# EAGLE design MaTouch DevKit_1.28“ Controller V1.1 (EAGLE 6.1)
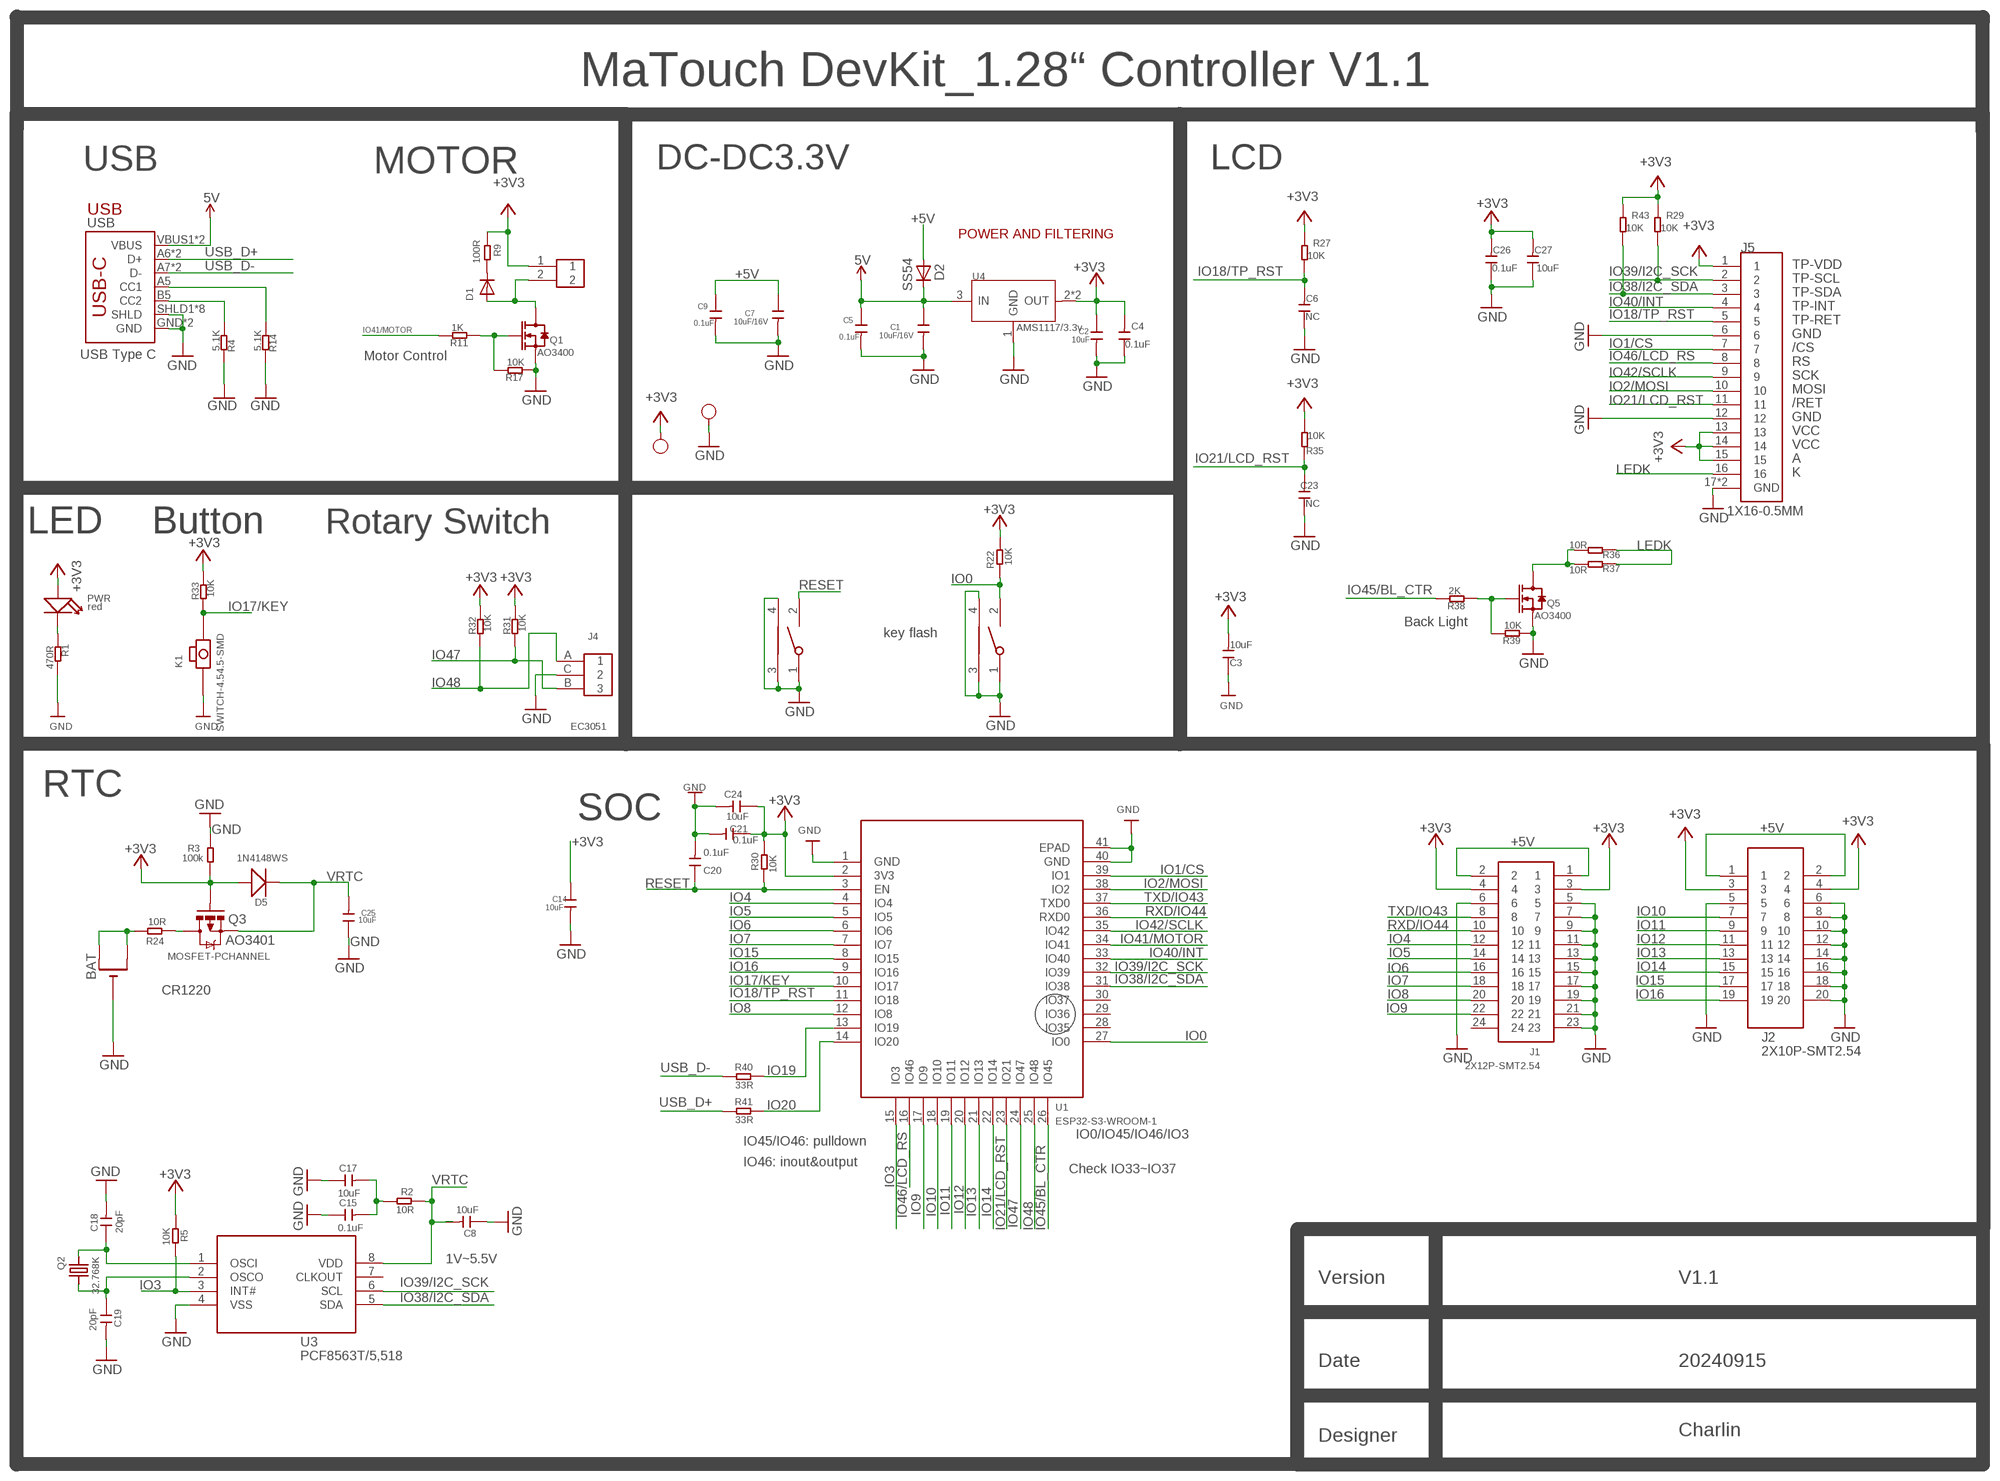
[diagram p0: schematic, sheet 1]

## Parts
3V3  TEST-POINT'4545'  [TP-D45MIL]
BAT  CR1220SMT  [CR1220-SMD]
BOOT  TS24CA  [2*4*3.5MM]
C1  10uF/16V  C-0603  [0603]
C2  10uF  C-0603  [0603]
C3  10uF  DISCRETE_C-0603  [DISCRETE_C0603]
C4  0.1uF  DISCRETE_C-0402  [DISCRETE_C0402]
C5  0.1uF  C-0603  [0603]
C6  NC  DISCRETE_C-0402  [DISCRETE_C0402]
C7  10uF/16V  C-0603  [0603]
C8  10uF  DISCRETE_C-0603  [DISCRETE_C0603]
C9  0.1uF  C-0603  [0603]
C14  10uF  C-0603  [0603]
C15  0.1uF  DISCRETE_C-0603  [DISCRETE_C0603]
C17  10uF  DISCRETE_C-0603  [DISCRETE_C0603]
C18  20pF  DISCRETE_C-0603  [DISCRETE_C0603]
C19  20pF  DISCRETE_C-0603  [DISCRETE_C0603]
C20  0.1uF  DISCRETE_C-0603  [DISCRETE_C0603]
C21  0.1uF  DISCRETE_C-0603  [DISCRETE_C0603]
C23  NC  DISCRETE_C-0402  [DISCRETE_C0402]
C24  10uF  DISCRETE_C-0603  [DISCRETE_C0603]
C25  10uF  C-0603  [0603]
C26  0.1uF  DISCRETE_C-0402  [DISCRETE_C0402]
C27  10uF  DISCRETE_C-0402  [DISCRETE_C0402]
D1  DIODESOD-323F  [SOD-323F]
D2  SS54  DIODE-DO-214AC  [DO-214AC]
D5  1N4148WS  D'0805'  [SOD323]
GND  TEST-POINT'4545'  [TP-D45MIL]
J1  2X12P-SMT2.54  [2X12P-SMT2.54]
J2  2X10P-SMT2.54  [2X10P-SMT2.54]
J4  EC3051  [MAKERFABS_EC3051]
J5  1X16-0.5MM  [1X16-0.5MM]
K1  SWITCH-4.54.5-SMD  [SWITCH-4.5*4.5-SMD]
MOTOR  CN-1.02P  [SH1.0-2P-SMD]
PWR  red  DISCRETE_LED0603  [DISCRETE_LED-0603]
Q1  AO3400  MOSFET-N'SOT23'  [SOT23@1]
Q2  32.768K  CRYSTAL_3215  [XTAL3215]
Q3  MOSFET-PCHANNEL  [SOT23-3]
Q5  AO3400  MOSFET-N'SOT23'  [SOT23@1]
R1  470R  DISCRETE_R-0402  [DISCRETE_R0402]
R2  10R  R-0603  [R0603]
R3  100k  R-0603  [R0603]
R4  5.1K  DISCRETE_R-0402  [DISCRETE_R0402]
R5  10K  R-0603  [R0603]
R9  100R  DISCRETE_R-0402  [DISCRETE_R0402]
R11  1K  DISCRETE_R-0402  [DISCRETE_R0402]
R14  5.1K  DISCRETE_R-0402  [DISCRETE_R0402]
R17  10K  DISCRETE_R-0402  [DISCRETE_R0402]
R22  10K  R-0603  [R0603]
R24  10R  R-0603  [R0603]
R27  10K  DISCRETE_R-0402  [DISCRETE_R0402]
R29  10K  DISCRETE_R-0402  [DISCRETE_R0402]
R30  10K  R-0603  [R0603]
R31  10K  DISCRETE_R-0402  [DISCRETE_R0402]
R32  10K  DISCRETE_R-0402  [DISCRETE_R0402]
R33  10K  DISCRETE_R-0402  [DISCRETE_R0402]
R35  10K  DISCRETE_R-0402  [DISCRETE_R0402]
R36  10R  DISCRETE_R-0402  [DISCRETE_R0402]
R37  10R  DISCRETE_R-0402  [DISCRETE_R0402]
R38  2K  DISCRETE_R-0402  [DISCRETE_R0402]
R39  10K  DISCRETE_R-0402  [DISCRETE_R0402]
R40  33R  R-0603  [R0603]
R41  33R  R-0603  [R0603]
R43  10K  DISCRETE_R-0402  [DISCRETE_R0402]
RST  TS24CA  [2*4*3.5MM]
U1  ESP32-S3-WROOM-1  [ESP32-S3-WROOM-1]
U3  PCF8563T/5,518  [SOP8]
U4  AMS1117/3.3v  LD1117'SOT89'  [SOT89]
USB  USB_C5  [USB-C-16P-5]

## Nets
5V: C1.1 C5.1 D2.C U4.3(IN) USB.VBUS1(VBUS) USB.VBUS2(VBUS)
+3V3: 3V3.T C2.1 C3.2 C4.2 C14.1 C21.1 C24.1 C26.2 C27.2 D5.+ J1.3 J1.4 J2.3 J2.4 J5.1 J5.13 J5.14 J5.15 MOTOR.1 PWR.+ Q3.1(G) R3.1 R5.1 R9.1 R22.2 R27.2 R29.2 R30.2 R31.1 R32.1 R33.1 R35.2 R43.2 U1.2(3V3) U4.2(OUT) U4.4(OUT)
+5V: C7.1 C9.1 D2.A J1.1 J1.2 J2.1 J2.2
GND: BAT.- BOOT.1 BOOT.3 BOOT.4 C1.2 C2.2 C3.1 C4.1 C5.2 C6.1 C7.2 C8.1 C9.2 C14.2 C15.1 C17.1 C18.2 C19.2 C20.2 C21.2 C23.1 C24.2 C25.1 C26.1 C27.1 GND.T J1.5 J1.6 J1.7 J1.9 J1.11 J1.13 J1.15 J1.17 J1.19 J1.21 J1.23 J2.5 J2.6 J2.8 J2.10 J2.12 J2.14 J2.16 J2.18 J2.20 J4.C J5.6 J5.12 J5.17(GND) J5.18(GND) K1.1 K1.4 Q1.2(S) Q5.2(S) R1.1 R3.2 R4.2 R14.2 R17.1 R39.1 RST.1 RST.3 RST.4 U1.1(GND) U1.40(GND) U1.41(EPAD) U3.4(VSS) U4.1(GND) USB.GND USB.GND2(GND) USB.SHLD1(SHLD) USB.SHLD2(SHLD) USB.SHLD3(SHLD) USB.SHLD4(SHLD) USB.SHLD5(SHLD) USB.SHLD6(SHLD) USB.SHLD7(SHLD) USB.SHLD8(SHLD)
IO0: BOOT.2 R22.1 U1.27(IO0)
IO1/CS: J5.7 U1.39(IO1)
IO2/MOSI: J5.10 U1.38(IO2)
IO3: R5.2 U1.15(IO3) U3.3(INT#)
IO4: J1.12 U1.4(IO4)
IO5: J1.14 U1.5(IO5)
IO6: J1.16 U1.6(IO6)
IO7: J1.18 U1.7(IO7)
IO8: J1.20 U1.12(IO8)
IO9: J1.22 U1.17(IO9)
IO10: J2.7 U1.18(IO10)
IO11: J2.9 U1.19(IO11)
IO12: J2.11 U1.20(IO12)
IO13: J2.13 U1.21(IO13)
IO14: J2.15 U1.22(IO14)
IO15: J2.17 U1.8(IO15)
IO16: J2.19 U1.9(IO16)
IO17/KEY: K1.2 K1.3 R33.2 U1.10(IO17)
IO18/TP_RST: C6.2 J5.5 R27.1 U1.11(IO18)
IO19: R40.2 U1.13(IO19)
IO20: R41.2 U1.14(IO20)
IO21/LCD_RST: C23.2 J5.11 R35.1 U1.23(IO21)
IO38/I2C_SDA: J5.3 R43.1 U1.31(IO38) U3.5(SDA)
IO39/I2C_SCK: J5.2 R29.1 U1.32(IO39) U3.6(SCL)
IO40/INT: J5.4 U1.33(IO40)
IO41/MOTOR: R11.2 U1.34(IO41)
IO42/SCLK: J5.9 U1.35(IO42)
IO45/BL_CTR: R38.2 U1.26(IO45)
IO46/LCD_RS: J5.8 U1.16(IO46)
IO47: J4.B R31.2 U1.24(IO47)
IO48: J4.A R32.2 U1.25(IO48)
LEDK: J5.16 R36.1 R37.1
M-: D1.A MOTOR.2 Q1.3(D)
N$1: Q1.1(G) R11.1 R17.2
N$2: C15.2 C17.2 R2.1
N$3: BAT.+$1(+) BAT.+$2(+1) R24.2
N$4: C18.1 Q2.P$1 U3.1(OSCI)
N$6: R14.1 USB.A5(CC1)
N$7: PWR.- R1.2
N$8: D1.C R9.2
N$13: C19.1 Q2.P$2 U3.2(OSCO)
N$14: R4.1 USB.B5(CC2)
N$15: Q3.3(D) R24.1
N$20: Q5.1(G) R38.1 R39.2
N$22: Q5.3(D) R36.2 R37.2
RESET: C20.1 R30.1 RST.2 U1.3(EN)
RXD/IO44: J1.10 U1.36(RXD0)
TXD/IO43: J1.8 U1.37(TXD0)
USB_D+: R41.1 USB.A6(D+) USB.B6(D+)
USB_D-: R40.1 USB.A7(D-) USB.B7(D-)
VRTC: C8.2 C25.2 D5.- Q3.2(S) R2.2 U3.8(VDD)
Unconnected: J1.24 U1.28(IO35) U1.29(IO36) U1.30(IO37) U3.7(CLKOUT)

## Notes on the sheet
- MaTouch DevKit_1.28“ Controller V1.1
- USB | MOTOR | DC-DC3.3V | LCD
- USB
- POWER AND FILTERING
- TP-VDD
- TP-SCL
- TP-SDA
- TP-INT
- TP-RET
- GND
- /CS
- USB Type C | Motor Control
- RS
- SCK
- MOSI
- /RET
- GND
- VCC
- VCC
- A
- K
- LED | Button | Rotary Switch
- Back Light
- key flash
- RTC
- SOC
- AO3401
- CR1220
- IO0/IO45/IO46/IO3
- IO45/IO46: pulldown
- IO46: inout&output
- Check IO33~IO37
- 1V~5.5V
- Version | V1.1
- Date | 20240915
- Charlin
- Designer

## Library data of the parts
3V3 GND = Discrete-new:TEST-POINT; PARTNO: DNP
BAT = adafruit:CR1220: CR1216/CR1220/CR1225 12mm 3V lithium coin cell Great for battery packup. Both SMT and THM holders. Note the THM package has the ground pads on both sides of the PCB so that the masks are the same - this reduces the cost
BOOT RST = sale:TS24CA
C1 C2 C5 C7 C9 C14 C25 = Discrete:C*: Ceramic Capacitors
C3 C4 C6 C8 C15 C17-C21 C23 C24 C26 C27 = A9G:DISCRETE_C*: Ceramic Capacitors
D1 = adafruit2:DIODE: Diode SMADIODE - SMA Surface Mount Package 20V 1A Schottky Diode Digikey: 641-1014-6-ND DO-1N4148 - Through Hole Small Current Diode SOD-123 20V 1 A (.5mV Vf) Schottky Diode - Digikey: MBRX120TPMSCT-ND SOD-323 10V 570mA (.38mV Vf, 3ns) Schottky Diode - Digikey: ZLLS410CT-ND SOD-523 30V 30mA Schottky Diode (RB751S-40TE61) - Digikey: RB751S-40TE61CT-ND SOT23-R/W - SOT23 Package (R = Solder Paste/Reflow Ovens, W = Hand-Soldering) BAT54Film 40V 300mA - Digikey: 497-7162-1-ND
D2 = diode:DIODE-: DIODE
D5 = Discrete:D*
J1 = sale:2X12P-SMT2.54
J2 = sale:2X10P-SMT2.54
J4 = Makerfabs-Peter:EC3051
J5 = Makerfabs:1X16-0.5MM
K1 = Makerfabs:SWITCH-4.5*4.5-SMD
MOTOR = Makerfabs-Peter:CN-1.0*2P
PWR = A9G:DISCRETE_LED*
Q1 Q5 = Discrete:MOSFET-N: IRLL014: http://www.vishay.com/docs/91319/sihll014.pdf
Q2 = microbuilder:CRYSTAL: Crystals HC49UP - Surface Mount Crystal 4.0MHz 18pF +/-30ppm Surface Mount Crystal [Digikey: 535-9857-1-ND] 12.0 MHz Surface Mount Crystal [Digikey: 535-9869-6-ND] 25.0 MHz Surface Mount Crystal [Digikey: 535-9078-1-ND] 2.5 x 2.0mm - MEMs SMT Crystal 16.0 MHz 10pF 20ppm 2.5 x 2.0mm Crystal [Digikey -40-85°C: 535-10923-1-ND] 3.2 x 2.5mm - MEMs SMT Crystal 12.0 MHz 8pF 15ppm 3.2 x 2.5mm Crystal [Digikey: -10-70°C: 644-1047-1-ND -40-125°C: 644-1128-1-ND] 40~85°C cheaper: 644-1173-6-ND 16.0 MHz 8pF 15ppm 3.2 x 2.5mm Crystal [Digikey: -10-70°C: 644-1049-1-ND -40-125°C: 644-1129-2-ND]-40~85°C cheaper: 644-1175-6-ND 16.0 MHz 10pF 10ppm 3.2 x 2.5mm Crystal [Digikey: 644-1100-1-ND] 27.12 MHz 18pF 30ppm 3.2 x 2.5mm Crystal [Digikey: 887-1424-1-ND] 27.12MHz 10pF 10ppm 3.2 x 2.5mm Crystal [Digikey: 887-1329-1-ND] 4.9 x 1.8mm - MEMs SMT Crystal 32.768 KHz 12.5pF 20ppm 4.9 x 1.8mm Crystal [Digikey: SE2415CT-ND] 8.0 x 3.8mm - Surface Mount Crystal 32.768kHz 12.5pF 20ppm -40°C-85°C [Digikey: 535-9166-2-ND] Cylinder 32.768KHz Cylinder Crystal (2x6mm body) [Ex. Digikey: 300-8341-2-ND]
Q3 = User-Submitted:MOSFET-PCHANNEL: Generic PMOSFET IRLML2244 - TRANS-11153 (SOT-23 -20V -4.3A) (1.Gate 2.Source 3.Drain) FQP27P06 - COM-10349 <http://www.sparkfun.com/products/10349> (TO-220 -60V -27A) (1.Gate 2.Source 3.Drain); PROD_ID: TRANS-08285
R1 R4 R9 R11 R14 R17 R27 R29 R31-R33 R35-R39 R43 = A9G:DISCRETE_R*
R2 R3 R5 R22 R24 R30 R40 R41 = Discrete:R*
U1 = self:ESP32-S3-WROOM-1
U3 = sale:PCF8563T/5,518
U4 = IC:LD1117: Low Drop Fixed And Adjustable Positive Voltage Regulators http://www.datasheetcatalog.org/datasheet/SGSThomsonMicroelectronics/mXuqtqv.pdf
USB = USBC:USB_C: USB Type C 16Pin Connector Super Speed pins not available on the 16-pin purely SMD connector so this part is best for USB 2.0 implementations. D1 and D2 are tied together enabling D+/- no matter which way the cable is plugged into the connector. The two channel configuration pins (CC1/2) are exposed. These are normally connected to ground via 5.1k resistors but can be reconfigured for high current/high power applications.

## Net classes
0 default: width 0.203 mm, drill 0.305 mm, clearance 0.152 mm
1 vbat: width 0.152 mm, drill 0.305 mm, clearance 0.203 mm

## Board
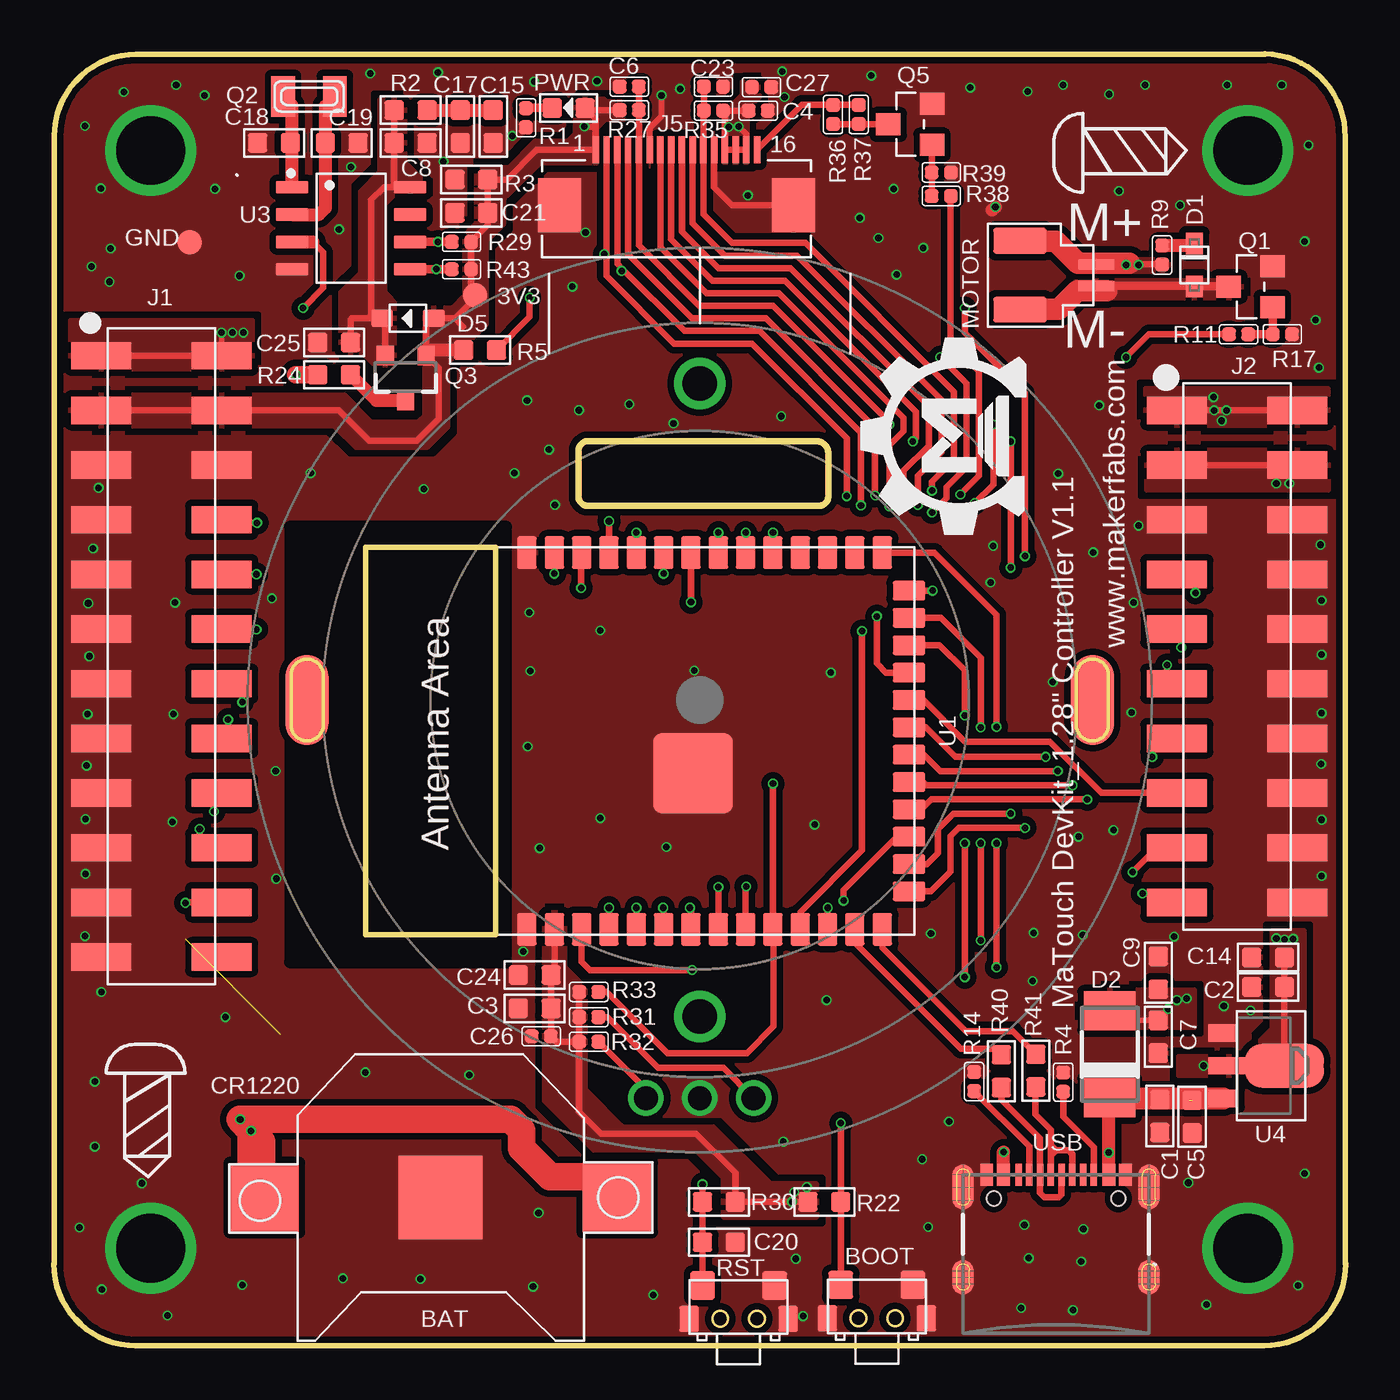
[diagram p1: board, top side]
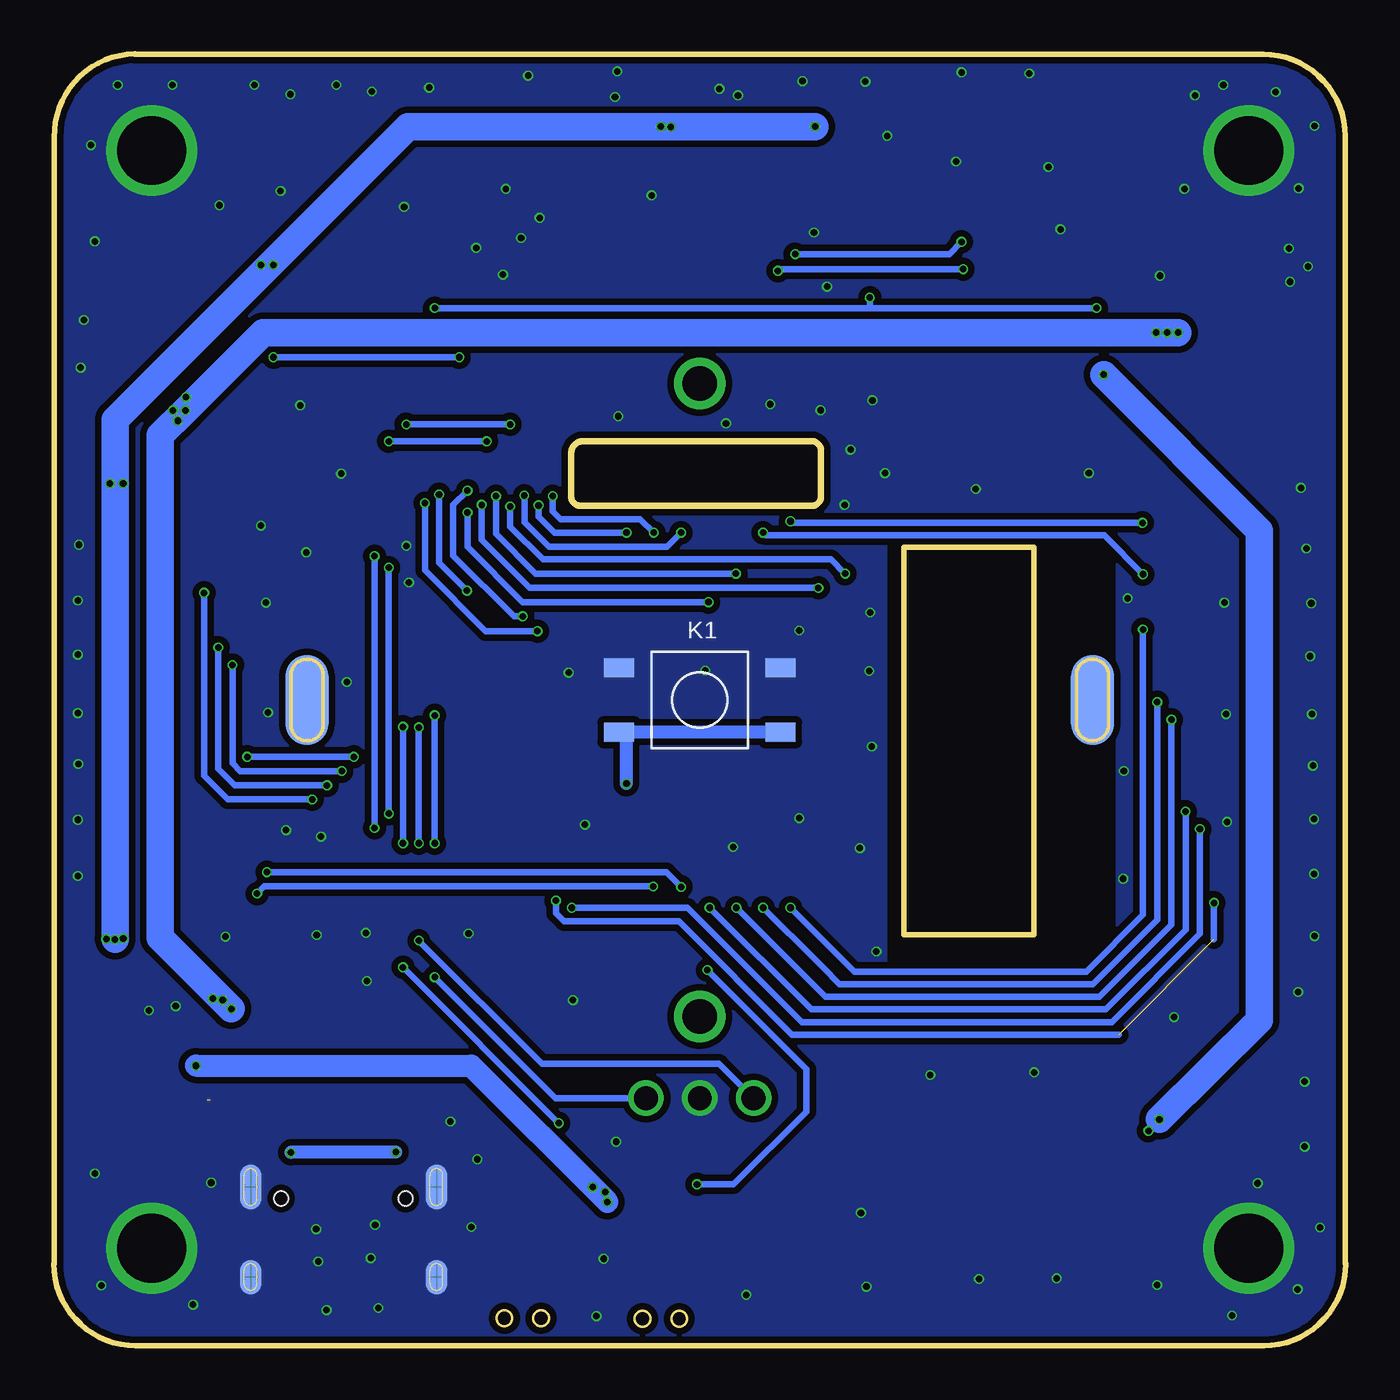
[diagram p2: board, bottom side, seen from below]

Size 60.05 x 60.02 mm. Coordinates in mm from the lower left corner, seen from the top.
Outline: 60.02,3.81 60.02,56.19
Outline: 0.02,3.81 0.02,56.19
Outline: 0,3.81 arc90 3.81,0
Outline: 3.83,60 arc90 0.03,56.19
Outline: 60.02,56.14 arc90 56.29,60.02
Outline: 56.29,60 3.91,60
Outline: 56.19,0 3.81,0
Outline: 56.24,0 arc90 60.05,3.81
Outline: 36,41.46 36,39.46 arc-90 35.57,39.03 24.79,39.03 arc-90 24.39,39.43 24.39,41.59 arc-90 24.83,42.03 35.43,42.03 arc-90 36,41.46
Outline: 20.52,19.1 20.52,37.09 14.5,37.09 14.5,19.1 20.52,19.1
Copper layers (1*16): Top 0.035mm / dielectric 1.5mm / Bottom 0.035mm
Design rules: minimum track width 4mil, minimum drill 10mil, track to track 4mil, track to pad 6mil, pad to pad 6mil, via to via 6mil, smd to smd 0mil, copper to edge 6mil, drill to drill 10mil, minimum pad ring 3mil, minimum via ring 3mil, stop-mask expansion 0mil, vias tented up to drill 100mil, thermal gap 0mil
tRestrict: area 11,17.8 to 21,38
bRestrict: area 11,17.8 to 21,38

### Footprints (pad centres in the part's own frame; a part is rotated, then mirrored left to right if it is on the bottom)
TP-D45MIL = smd 1.143 x 1.143: T 0,0
CR1220-SMD = smd 3.2 x 3.2: +$1 -8.2,0; +$2 8.2,0 | smd 3.9 x 3.9: - 0,0
2*4*3.5MM = smd 1.15 x 1.3: 1 -1.675,0; 2 1.675,0 | smd 0.9 x 1.2: 3 2.3,1.55; 4 -2.3,1.55
0603 = smd 0.889 x 0.889: 1 -0.762,0; 2 0.762,0
DISCRETE_C0603 = smd 0.889 x 0.889: 1 -0.762,0; 2 0.762,0
DISCRETE_C0402 = smd 0.635 x 0.635: 1 -0.445,0; 2 0.445,0
SOD-323F = smd 1 x 0.8: A -1,0; C 1,0
DO-214AC = smd 1.8 x 2.4: A 2.025,0; C -2.025,0
SOD323 = smd 1 x 0.8: + -1.2,0; - 1.2,0
2X12P-SMT2.54 = smd 1.27 x 2.8: 1 -13.97,-2.8; 2 -13.97,2.8; 3 -11.43,-2.8; 4 -11.43,2.8; 5 -8.89,-2.8; 6 -8.89,2.8; 7 -6.35,-2.8; 8 -6.35,2.8; 9 -3.81,-2.8; 10 -3.81,2.8; 11 -1.27,-2.8; 12 -1.27,2.8; 13 1.27,-2.8; 14 1.27,2.8; 15 3.81,-2.8; 16 3.81,2.8; 17 6.35,-2.8; 18 6.35,2.8; 19 8.89,-2.8; 20 8.89,2.8; 21 11.43,-2.8; 22 11.43,2.8; 23 13.97,-2.8; 24 13.97,2.8
2X10P-SMT2.54 = smd 1.27 x 2.8: 1 -11.43,-2.8; 2 -11.43,2.8; 3 -8.89,-2.8; 4 -8.89,2.8; 5 -6.35,-2.8; 6 -6.35,2.8; 7 -3.81,-2.8; 8 -3.81,2.8; 9 -1.27,-2.8; 10 -1.27,2.8; 11 1.27,-2.8; 12 1.27,2.8; 13 3.81,-2.8; 14 3.81,2.8; 15 6.35,-2.8; 16 6.35,2.8; 17 8.89,-2.8; 18 8.89,2.8; 19 11.43,-2.8; 20 11.43,2.8
MAKERFABS_EC3051 = drill 1.6: 4 -14.7,0; 6 14.7,0 | drill 1.1: A -18.5,2.5; B -18.5,-2.5; C -18.5,0 | smd 4.2 x 2: SHLD9 0,-18.25; SHLD10 0,18.25 | smd 4.2 x 2 bottom: SHLD13 0,-18.25; SHLD16 0,18.25
1X16-0.5MM = smd 0.3 x 1.27: 1 -3.81,2.54; 2 -3.31,2.54; 3 -2.81,2.54; 4 -2.31,2.54; 5 -1.81,2.54; 6 -1.31,2.54; 7 -0.81,2.54; 8 -0.31,2.54; 9 0.19,2.54; 10 0.69,2.54; 11 1.19,2.54; 12 1.69,2.54; 13 2.19,2.54; 14 2.69,2.54; 15 3.19,2.54; 16 3.69,2.54 | smd 2 x 2.5: 17 -5.5,-0.035; 18 5.38,-0.035
SWITCH-4.5*4.5-SMD = smd 1.4 x 0.9: 1 -3.75,1.5; 2 -3.75,-1.5; 3 3.75,-1.5; 4 3.75,1.5
SH1.0-2P-SMD = smd 0.5 x 1.7: 1 1.1,3.54; 2 2.1,3.54 | smd 1.2 x 2.5: 3 0,0; 4 3.2,0
DISCRETE_LED-0603 = smd 0.889 x 0.889: + -0.762,0; - 0.762,0
SOT23@1 = smd 1.016 x 1.143: 1 -0.95,-1.016; 2 0.95,-1.016; 3 0,1.016
XTAL3215 = smd 1.1 x 1.9: P$1 1.2,0; P$2 -1.2,0
SOT23-3 = smd 0.8 x 0.9: 1 -0.95,-1; 2 0.95,-1; 3 0,1.1
DISCRETE_R0402 = smd 0.635 x 0.635: 1 -0.445,0; 2 0.445,0
R0603 = smd 0.889 x 0.889: 1 -0.762,0; 2 0.762,0
ESP32-S3-WROOM-1 = smd 1.5 x 0.9: 1 -8.75,5.26; 2 -8.75,3.99; 3 -8.75,2.72; 4 -8.75,1.45; 5 -8.75,0.18; 6 -8.75,-1.09; 7 -8.75,-2.36; 8 -8.75,-3.63; 9 -8.75,-4.9; 10 -8.75,-6.17; 11 -8.75,-7.44; 12 -8.75,-8.71; 13 -8.75,-9.98; 14 -8.75,-11.25; 27 8.75,-11.25; 28 8.75,-9.98; 29 8.75,-8.71; 30 8.75,-7.44; 31 8.75,-6.17; 32 8.75,-4.9; 33 8.75,-3.63; 34 8.75,-2.36; 35 8.75,-1.09; 36 8.75,0.18; 37 8.75,1.45; 38 8.75,2.72; 39 8.75,3.99; 40 8.75,5.26 | smd 0.9 x 1.5: 15 -6.985,-12.5; 16 -5.715,-12.5; 17 -4.445,-12.5; 18 -3.175,-12.5; 19 -1.905,-12.5; 20 -0.635,-12.5; 21 0.635,-12.5; 22 1.905,-12.5; 23 3.175,-12.5; 24 4.445,-12.5; 25 5.715,-12.5; 26 6.985,-12.5 | smd 3.7 x 3.7: 41 -1.5,-2.46
SOP8 = smd 1.52 x 0.6: 1 -2.74,1.905; 2 -2.74,0.635; 3 -2.74,-0.635; 4 -2.74,-1.905; 5 2.74,-1.905; 6 2.74,-0.635; 7 2.74,0.635; 8 2.74,1.905
SOT89 = smd 0.8 x 1.4: 1 -1.524,-1.905; 3 1.524,-1.905 | smd 0.8 x 1.9: 2 0,-1.651 | smd 2.032 x 3.65: 4 0,0.94
USB-C-16P-5 = smd 0.3 x 1: A5 -1.25,-0.34; A6 -0.25,-0.34; A7 0.25,-0.34; A8 1.25,-0.34; B5 1.75,-0.34; B6 0.75,-0.34; B7 -0.75,-0.34; B8 -1.75,-0.34 | smd 0.6 x 1: GND -3.225,-0.34; GND2 3.225,-0.34; VBUS1 -2.45,-0.34; VBUS2 2.45,-0.34 | smd 1 x 2.1: SHLD1 -4.32,-0.915; SHLD2 4.32,-0.915 | smd 1 x 2.1 bottom: SHLD3 -4.32,-0.915; SHLD4 4.32,-0.915 | smd 1 x 1.6: SHLD5 -4.32,-5.095; SHLD8 4.32,-5.095 | smd 1 x 1.6 bottom: SHLD6 -4.32,-5.095; SHLD7 4.32,-5.095 | hole 0.65: -2.89,-1.445; 2.89,-1.445

### Placement (x,y rotation side)
3V3  19.58,48.8 0 top
BAT  17.98,6.89 180 top
BOOT  38.25,2.82 180 top
C1  51.41,10.67 270 top
C2  56.44,16.66 180 top
C3  22.35,15.67 0 top
C4  32.74,57.38 180 top
C5  52.91,10.65 270 top
C6  26.75,58.5 0 top
C7  51.33,14.35 270 top
C8  16.59,55.88 180 top
C9  51.33,17.33 90 top
C14  56.44,18.04 180 top
C15  20.42,56.64 90 top
C17  18.9,56.64 90 top
C18  10.24,55.88 180 top
C19  13.39,55.88 0 top
C20  30.91,4.8 0 top
C21  19.41,52.63 180 top
C23  30.66,58.5 180 top
C24  22.35,17.22 180 top
C25  13.03,46.61 0 top
C26  22.66,14.38 0 top
C27  32.89,58.47 180 top
D1  53.01,50.22 90 top
D2  49.07,13.54 90 top
D5  16.46,47.73 180 top
GND  6.32,51.26 0 top
J1  5,32.03 270 top
J2  55,32.03 270 top
J4  30.02,30 90 top
J5  29,53.03 0 top
K1  30.02,30 0 bottom
MOTOR  44.91,51.34 270 top
PWR  23.93,57.51 180 top
Q1  55.63,49.2 90 top
Q2  11.86,58.04 180 top
Q3  16.36,45.01 180 top
Q5  39.8,56.75 90 top
R1  21.95,57.05 90 top
R2  16.59,57.41 180 top
R3  19.41,54.18 180 top
R4  46.91,12.25 90 top
R5  19.81,46.26 0 top
R9  51.51,50.68 90 top
R11  55.07,46.99 180 top
R14  42.77,12.27 90 top
R17  57.1,46.99 180 top
R22  35.81,6.68 180 top
R24  13.03,45.11 180 top
R27  26.75,57.41 180 top
R29  18.95,51.29 0 top
R30  30.91,6.68 0 top
R31  24.87,15.27 0 top
R32  24.87,14.12 0 top
R33  24.87,16.44 0 top
R35  30.66,57.38 0 top
R36  36.22,57.2 270 top
R37  37.41,57.2 270 top
R38  41.25,53.42 0 top
R39  41.25,54.51 180 top
R40  44.04,12.75 90 top
R41  45.64,12.78 90 top
R43  18.95,50.02 0 top
RST  31.83,2.8 180 top
U1  27.25,28.09 90 top
U3  13.82,51.92 0 top
U4  56.26,13.01 270 top
U$1  [MAKERFABS_0.3]  45.13,38.16 90 top
USB  46.58,8.28 0 top

### Tracks (layer width: path | path; a pad name or v marks a point on that pad's centre or on a via)
5V  (via drill 0.3)  (1 unrouted)
  Top 0.254: 52.78,11.41 52.7,11.48 | C1.1 51.64,11.51 51.66,11.48
  Top 0.61: USB.VBUS2 v49.03,8.97 49.03,11.48 D2.C | USB.VBUS1 44.13,8.98 v44.15,8.99
  Top 1.016: U4.3 52.7,11.48 51.66,11.48 49.1,11.48 D2.C
  Bottom 0.61: v44.15,8.99 49.01,8.99 v49.03,8.97
+3V3  (via drill 0.3)
  Top 0.305: C2.1 U4.4 U4.2 v53.44,13.01 | C2.1 | U1.2 23.26,17.37 C24.1 C3.2 23.1,15.66 C26.2 23.36,14.12 R32.1 | R32.1 R31.1 R33.1 | R32.1 24.42,10.86 25.43,9.86 29.84,9.86 31.67,8.03 R30.2 v34.31,6.68 R22.2 | C2.1 57.2,18.12 | R27.2 24.79,57.41 PWR.+ 25.19,57.01 25.19,56.64 | 25.19,56.64 J5.1 22.44,55.57 21.06,54.18 R3.1 C21.1 20.17,52.06 R29.2 R43.2 19.39,48.48 | C4.2 R35.2 31.19,57.29 J5.13 J5.14 J5.15 32.19,56.28 v31.83,56.64 | R9.1 MOTOR.1 | J2.3 J2.4 57.96,40.78 | J1.3 J1.4 13.24,43.46 14.66,42.04 16.87,42.04 17.88,43.06 17.88,45.44 Q3.1 17.31,47.38 D5.+ 18.64,47.73 | 19.39,48.48 18.64,47.73 | v24.66,56.64 25.19,56.64 | 19.02,47.35 18.64,47.73 | 19.39,48.48 arc90 19.58,48.67 3V3.T
  Top 0.61: 47.6,50.3 48.44,50.3 48.44,50.22 | R5.1 17.31,46.26 Q3.1
  Top 1: 44.4,51.31 46.58,51.31 47.6,50.3 49.99,50.3
  Bottom 0.254: 43.59,56.64 49.84,50.4 v49.84,50.22 | 57.2,43.03 57.43,42.8 v57.43,40.06
  Bottom 0.305: v24.66,56.64 v31.83,56.64 42.67,56.64
  Bottom 1.016: v53.44,13.01 40.64,13.01 v34.31,6.68
  Bottom 1.27: v57.2,18.88 57.2,43.03 43.59,56.64 v24.66,56.64
  other vias: 56.82,40.06 50.42,50.22 57.61,18.9 56.82,18.93 31.37,56.62 34.42,7.14 35,7.37
  pour Top: 50.8,41.61 59.23,41.61 59.23,39.78 50.8,39.78
  pour Top: 47.57,49.91 51.87,49.91 51.87,50.45 47.57,50.45
  pour Top: 56.64,19.28 58.09,19.28 58.09,12.58 52.3,12.58 52.3,13.41 55.35,13.41 56.64,14.71
  pour Top: 0.79,44.15 13.49,44.15 14.73,42.9 16.94,42.9 17.25,43.21 17.25,47.96 17.5,48.21 18.54,48.21 19.13,48.8 19.13,51.59 19.66,52.12 19.66,54.54 19.86,54.74 21.18,54.74 22.4,55.96 23.93,55.96 24.26,56.29 24.26,57.91 25.55,57.91 25.68,57.79 26.49,57.79 26.49,56.97 25.63,56.97 25.22,56.57 25.22,54.97 22.58,54.97 21.03,53.42 20.9,53.29 20.9,52.15 20.09,51.34 20.09,48.31 20.09,47.48 18.31,45.7 18.31,42.73 17.32,41.73 14.05,41.73 13.03,42.75 0.84,42.75 0.79,42.75
  pour Top: 31.14,54.99 31.14,57.61 31.52,57.61 32,58.09 32,58.73 32.92,58.73 32.92,58.14 32.21,57.43 32.21,54.99
  pour Top: 22.83,20.09 22.83,11.38 25.1,9.12 29.82,9.12 31.14,7.8 31.14,6 35.43,6 35.43,7.5 33.3,7.5 30.66,10.14 26.44,10.14 24.66,11.92 24.66,16.64 23.72,17.58 23.72,20.07 23.72,20.09
+5V  (via drill 0.3)
  Top 0.254: J1.2 v7.8,47.07 | D2.A 49.52,15.12 C7.1 51.37,15.08
  Top 0.305: J2.2 v53.92,43.46 J2.1 | J1.1 J1.2
  Bottom 1.27: v7.8,47.07 50.31,47.07 v53.92,43.46 55.09,42.29 55.09,18.95 v51.79,15.65
  other vias: 52.2,16.06 54.5,43.46 53.9,44.07 54.28,42.98 8.31,47.07 8.81,47.07 52.65,16.13
  pour Top: 50.75,44.45 59.21,44.45 59.21,42.78 50.75,42.78
  pour Top: 0.79,47.63 9.22,47.63 9.22,45.39 0.79,45.39
  pour Top: 53.01,14.79 47.88,14.79 47.88,16.51 53.01,16.51
GND  (via drill 0.3, 3.2)
  Top 0.254: 27.69,56.57 28.25,57.13 v28.25,58.09
  Top 0.305: J5.12 30.69,53.82 31.52,52.99 J5.18 | J5.6 27.69,56.57
  Top 0.61: 43.61,52.76 v43.76,52.91
  other vias: 5.28,1.4 2.24,2.62 1.91,9.25 4.09,7.55 1.91,12.27 8.76,2.82 4.5,4.53 55.5,4.53 5.69,58.57 1.19,5.49 2.21,16.44 45.26,58.27 3.25,58.24 29.11,58.4 49.05,58.14 52.35,52.99 46.91,58.57 50.72,58.57 54.53,58.57 57.07,58.57 1.45,56.67 7.01,58.09 2.64,50.98 2.18,53.77 1.75,50.14 17.86,59.16 2.59,49.43 4.5,55.53 55.5,55.53 2.08,39.86 1.83,37.04 1.6,34.5 1.65,32.03 1.57,29.34 1.52,26.95 1.47,24.46 1.47,21.92 1.45,19.03 19.3,12.58 14.48,12.7 7.98,15.27 10.13,34.72 10.31,26.7 5.56,29.34 5.64,34.52 5.51,24.34 22.58,23.12 28.47,23.17 35.36,24.21 36.12,31.27 29.77,31.37 22.1,34.06 22.15,31.35 22.02,27.84 25.4,33.23 25.4,24.51 43.54,35.46 43.66,37.16 21.41,40.54 17.2,39.8 11.94,40.54 22,43.92 26.75,43.74 33.81,43.18 23.29,39.07 23.01,41.63 24.41,43.46 28.8,42.85 24.71,51.72 24.1,49.2 13.82,54.77 14.71,59.11 7.49,53.75 8.64,49.71 13.26,51.87 18.11,55.02 21.31,56.21 22.33,58.73 25.25,58.75 33.86,59.21 33.96,58.02 32.26,53.44 39.17,49.76 39.04,53.75 37.47,52.4 40.41,51.01 42.6,58.45 38,59.01 58.32,55.78 58.14,51.31 58.65,47.65 58.8,45.44 48.59,43.69 46.69,40.52 48.31,36.86 58.88,37.21 58.93,34.62 58.93,32.11 58.93,29.39 58.9,27.03 58.93,24.44 58.93,21.82 58.14,8 57.84,2.8 53.57,1.91 47.75,3.91 45.31,4.07 47.85,5.41 45.11,5.62 52.73,7.57 47.37,1.65 44.96,1.76 40.64,5.51 41.61,10.42 40.36,8.66 33.91,9.48 35.92,16.06 40.77,19.15 47.83,19.08 45.54,19.18 45.49,16.94 27.86,2.36 22.53,6.17 22.28,2.75 17.04,3.1 13.44,3.13 10.34,21.69 21.82,18.32 34.49,4.04 34.82,1.37 54.38,15.78 55.63,15.57 52.07,19 49.25,23.95 47.62,23.65 50.19,34.52 50.09,29.42 46.43,30.84 50.42,38.1 49.5,53.65 38.33,51.46
  pour Bottom (isolate 0.305, rank 6): -5,60.99 60.96,60.99 60.96,-19.97 -5,-19.97
  pour Top (isolate 0.305, rank 6): -6,62.26 -6,-19.97 64.77,-19.97 64.77,62.26
IO0  (via drill 0.3)
  Top 0.305: BOOT.2 R22.1 v36.58,10.34 | U1.27 40.93,36.84 43.81,33.96 v43.81,28.75 | v43.81,23.34 v43.81,17.58
  Bottom 0.305: v43.81,28.75 v43.81,23.34 | v36.58,10.34 v43.81,17.58
IO1/CS  (via drill 0.3)
  Top 0.305: U1.39 v23.26,35.87 v23.27,35.87 | v38.84,38.99 38.84,41.84 39.5,42.5 39.5,43.11 33.71,48.9 30.33,48.9 28.19,51.03 J5.7
  Bottom 0.305: v23.27,35.87 23.93,36.53 37.31,36.53 38.84,38.05 v38.84,38.99
IO2/MOSI  (via drill 0.3)
  Top 0.305: U1.38 24.51,36.82 v24.51,35.21 | v40.16,39.07 40.16,40.41 41.25,41.51 41.25,43.95 34.54,50.65 31.19,50.65 29.69,52.15 J5.10
  Bottom 0.305: v24.51,35.21 37.92,35.21 40.16,37.44 v40.16,39.07
IO3  (via drill 0.3)
  Top 0.305: U1.15 40.77,21.11 41.68,22.02 41.68,23.67 42.06,24.06 v45.14,24.06 | v45.14,36.68 45.14,44.27 42.34,47.07 v42.34,48.21 | 12.04,51.28 12.52,50.8 12.52,49.15 v11.58,48.21 | R5.2 22.12,47.8 v22.12,48.69
  Top 0.61: U3.3 12.04,51.28
  Bottom 0.305: v45.14,36.68 v45.14,24.06 | v42.34,48.21 22.12,48.21 | 22.12,48.21 22.1,48.21 | 22.1,48.21 22.07,48.21 | 22.07,48.21 v11.58,48.21 22.07,48.21 | v22.12,48.69 22.12,48.21 | 22.12,48.21 22.1,48.21 | 22.1,48.21 22.12,48.21 | 22.12,48.21 22.1,48.21 | 22.1,48.21 22.07,48.21
IO4  (via drill 0.3)
  Top 0.305: J1.12 7.82,33.28 v9.42,33.28 | U1.4 v25.8,20.35 v25.81,20.35
  Bottom 0.305: v25.81,20.35 22.84,17.38 12.06,17.38 9.42,20.02 v9.42,33.28
IO5  (via drill 0.3)
  Top 0.305: J1.14 8.07,30.48 8.64,30.48 8.76,30.36 v8.76,29.9 | U1.5 v27.07,20.35 v27.08,20.35
  Bottom 0.305: v27.08,20.35 24.56,17.83 24.31,17.58 23.52,16.79 11.76,16.79 8.76,19.79 v8.76,29.9
IO6  (via drill 0.3)
  Top 0.305: U1.6 28.34,20.32 v28.32,20.35 | v8.1,29.09 8.1,28.52 J1.16
  Bottom 0.305: v28.32,20.35 24.18,16.21 11.46,16.21 8.1,19.56 v8.1,29.09
IO7  (via drill 0.3)
  Top 0.305: U1.7 29.61,20.3 v29.57,20.35 | v7.44,24.82 7.44,25.32 J1.18
  Bottom 0.305: v29.57,20.35 24.84,15.62 11.15,15.62 7.44,19.33 v7.44,24.82
IO8  (via drill 0.3)
  Top 0.305: U1.12 v35.96,20.35 v35.97,20.35 | v6.78,24.01 6.78,23.42 6.81,23.4 7.54,23.4 J1.20
  Bottom 0.305: v35.97,20.35 30.58,20.35 25.27,15.04 10.87,15.04 6.78,19.13 v6.78,24.01
IO9  (via drill 0.3)  (1 unrouted)
  Top 0.305: U1.17 39.19,23.65 36.7,21.16 v36.7,20.68 | J1.22 6.14,20.6 v6.12,20.58
  Bottom 0.305: v36.7,20.68 36.7,20.09 36.32,19.71 30.99,19.71 25.73,14.46 10.54,14.46 | v6.12,20.58 6.12,18.88
IO10  (via drill 0.3)
  Top 0.305: 52.23,35.84 J2.7 52.42,35.64 52.88,35.64 53.06,35.46 v53.06,34.98 | U1.18 40.34,24.92 40.79,25.38 v48.03,25.38
  Bottom 0.305: v53.06,34.98 53.06,26.47 51.97,25.38 v48.03,25.38
IO11  (via drill 0.3)
  Top 0.305: U1.19 40.41,26.19 40.56,26.04 v47.35,26.04 | 52.38,33.3 J2.9 52.4,33.12 v52.4,32.44
  Bottom 0.305: v52.4,32.44 52.4,26.8 51.64,26.04 v47.35,26.04
IO12  (via drill 0.3)
  Top 0.305: 52.58,30.4 J2.11 51.74,31.24 v51.74,31.63 | v46.66,26.7 41.2,26.7 40.44,27.46 U1.20
  Bottom 0.305: v51.74,31.63 51.74,27.05 51.38,26.7 v46.66,26.7
IO13  (via drill 0.3)
  Top 0.305: v51.05,27.36 51.05,27.71 51.56,28.22 52.22,28.22 J2.13 | U1.21 40.54,28.73 41.91,27.36 v46.1,27.36
  Bottom 0.305: v46.1,27.36 v51.05,27.36
IO14
  Top 0.305: J2.15 52.22,25.68 48.69,25.68 46.3,28.07 42.34,28.07 40.41,30 U1.22
IO15  (via drill 0.3)
  Top 0.305: J2.17 51.28,23.14 v50.14,22 | U1.8 v30.88,21.31 v30.89,21.31
  Bottom 0.305: v50.14,22 31.57,22 v30.89,21.31
IO16  (via drill 0.3)
  Top 0.305: 52.22,20.6 J2.19 51.81,21.01 v50.6,21.01 | U1.9 32.15,21.31 v32.18,21.34
  Bottom 0.305: v32.18,21.34 50.27,21.34 v50.6,21.01
IO17/KEY  (via drill 0.3)
  Top 0.305: R33.2 25.68,16.44 28.52,13.59 32.21,13.59 33.45,14.84 33.45,19.32 U1.10 v33.42,26.11 v33.43,26.11
  Bottom 0.61: K1.3 33.17,28.5 | 33.17,28.5 K1.2 | v33.43,26.11 33.43,28.25 33.17,28.5
IO18/TP_RST  (via drill 0.3)
  Top 0.305: C6.2 R27.1 J5.5 27.19,51.12 30,48.31 33.43,48.31 38.84,42.9 v38.84,42.8 | U1.11 34.7,20.14 37.57,23.01 37.57,23.75 37.57,24.06 v37.57,33.2 | v43.66,42.8 43.66,40.01 v42.8,39.14
  Bottom 0.305: v43.66,42.8 v38.84,42.8 | v42.8,39.14 42.8,36.02 39.98,33.2 v37.57,33.2
IO19
  Top 0.305: U1.13 37.23,18.72 42.16,13.79 43.76,13.79 R40.2
IO20
  Top 0.305: U1.14 38.5,18.5 42.39,14.61 44.58,14.61 R41.2
IO21/LCD_RST  (via drill 0.3)
  Top 0.305: C23.2 R35.1 30.19,57.36 J5.11 30.19,52.57 31.52,51.23 34.92,51.23 41.83,44.33 41.83,41.15 40.82,40.13 v40.82,39.73 | U1.23 38.68,31.27 38.25,31.7 v38.25,33.89
  Bottom 0.305: v40.82,39.73 41.48,39.07 41.48,36.71 38.66,33.89 v38.25,33.89
IO38/I2C_SDA  (via drill 0.3)
  Top 0.305: U1.31 v33.42,37.77 v33.43,37.77 | v37.52,39.04 37.52,42.42 32.79,47.14 29.31,47.14 26.39,50.07 | J5.3 26.19,50.27 26.39,50.07 | 26.39,50.07 v26.39,49.94
  Top 0.406: U3.5 v17.78,50.02 R43.1
  Bottom 0.305: v33.43,37.77 36.78,37.77 37.52,38.51 v37.52,39.04 | v17.78,50.02 26.31,50.02 v26.39,49.94
IO39/I2C_SCK  (via drill 0.3)
  Top 0.305: U1.32 v32.15,37.77 v32.16,37.77 | v36.85,39.47 36.85,42.17 32.46,46.56 28.83,46.56 25.69,49.7 25.69,50.65 | J5.2 25.69,50.65 | v25.59,50.72 25.62,50.72 25.69,50.65
  Top 0.406: U3.6 v17.86,51.28 R29.1
  Bottom 0.305: v32.16,37.77 32.79,38.41 36.5,38.41 36.85,38.76 v36.85,39.47 | v25.59,50.72 18.43,50.72 v17.86,51.28
IO40/INT  (via drill 0.3)
  Top 0.305: U1.33 v30.88,37.77 v30.89,37.77 | v38.18,39.5 38.18,42.65 33.1,47.73 29.67,47.73 26.69,50.71 J5.4
  Bottom 0.305: v30.89,37.77 31.55,37.11 37.03,37.11 38.18,38.25 v38.18,39.5
IO41/MOTOR  (via drill 0.3)
  Top 0.305: U1.34 v29.61,34.55 v29.62,34.55 | v40.82,38.71 41.48,39.37 41.48,39.88 42.42,40.82 42.42,44.71 v41.2,45.93 | v49.84,45.93 50.9,46.99 R11.2
  Bottom 0.305: v29.62,34.55 38.25,34.55 40.82,37.11 v40.82,38.71 | v49.84,45.93 v41.2,45.93
IO42/SCLK  (via drill 0.3)
  Top 0.305: v28.35,35.87 U1.35 | v39.5,39.47 39.5,40.64 40.66,41.81 40.66,43.64 34.24,50.07 30.89,50.07 29.19,51.76 J5.9
  Bottom 0.305: v39.5,39.47 39.5,37.72 37.64,35.87 v28.35,35.87
IO45/BL_CTR  (via drill 0.3)
  Top 0.305: U1.26 v40.84,35.08 | v42.14,39.55 43,40.41 43,45.27 41.68,46.59 41.68,53.41 R38.2
  Bottom 0.305: v40.84,35.08 42.14,36.38 v42.14,39.55
IO46/LCD_RS  (via drill 0.3)
  Top 0.305: v39.93,42.01 40.08,42.17 40.08,43.39 33.98,49.48 30.61,49.48 28.69,51.4 J5.8 | U1.16 40.59,22.38 41.1,22.89 41.1,24.01 41.81,24.72 v44.48,24.72 | v44.48,36.15 v44.48,42.01
  Bottom 0.305: v44.48,42.01 v39.93,42.01 | v44.48,24.72 v44.48,36.15
IO47  (via drill 0.3)
  Top 0.305: R31.2 25.73,15.27 28.09,12.91 31.12,12.91 J4.B | U1.24 41.17,32.54 42.34,31.37 v42.34,29.29 | v42.34,23.34 v42.34,17.12
  Bottom 0.305: v42.34,29.29 v42.34,23.34 | v42.34,17.12 36.72,11.5 J4.B
IO48  (via drill 0.3)
  Top 0.305: J4.A 27.52,11.91 R32.2 | U1.25 41.22,33.81 43.08,31.96 v43.08,28.73 | v43.08,23.34 v43.08,18.82
  Bottom 0.305: J4.A 29.13,13.11 37.36,13.11 v43.08,18.82 | v43.08,28.73 v43.08,23.34
LEDK
  Top 0.305: J5.16 34.77,57.65 R36.1 R37.1
M-
  Top 0.406: MOTOR.2 52.99,49.24 D1.A 54.59,49.22 Q1.3
  Top 0.61: 48.95,49.02 48.45,49.02 MOTOR.2
  Top 1: 48.95,49.02 47.57,49.02 46.71,48.16 44.35,48.16
  pour Top: 47.52,49.48 55.19,49.48 55.19,48.69 47.52,48.69
N$1
  Top 0.406: R11.1 R17.2 56.66,48.24 Q1.1
N$2
  Top 0.61: R2.1 C17.2 C15.2
N$3  (via drill 0.3)
  Top 0.813: R24.2 v11.25,45.11
  Top 1.27: 9.55,7.04 9.7,6.89 | 9.7,6.89 9.65,6.83 9.65,9.48 v8.66,10.52 21.23,10.52 21.74,10.01 21.74,9.17 23.06,7.85 25.22,7.85 BAT.+$1 | 9.7,6.89 BAT.+$2 9.17,7.5 v9.17,9.99
  Bottom 1.27: v11.25,45.11 4.01,37.87 4.01,15.12 v8.66,10.52
N$4
  Top 0.61: U3.1 11.08,55.86 | 11.08,55.86 11.08,57.63 Q2.P$1 | C18.1 11.05,55.88 11.08,55.86
N$6
  Top 0.305: USB.A5 45.33,9.27 R14.1
N$7
  Top 0.305: R1.2
  Top 0.406: PWR.- R1.2
N$8
  Top 0.61: R9.2 52.91,51.12 D1.C
N$13
  Top 0.61: U3.2 12.32,52.55 12.62,52.86 C19.1 12.62,55.91 12.62,57.6 Q2.P$2
N$14
  Top 0.305: USB.B5 48.33,9.22 46.91,10.65 R4.1
N$15
  Top 0.61: Q3.3 14.99,43.91 R24.1
N$20
  Top 0.305: R38.1 R39.2 40.8,55.78 Q5.1
N$22
  Top 0.305: R36.2 R37.2 37.43,56.75 Q5.3
RESET  (via drill 0.3)
  Top 0.305: RST.2 C20.1 R30.1 v30.15,7.5 | U1.3 24.53,17.84 24.92,17.45 v29.67,17.45
  Bottom 0.305: v30.15,7.5 28.45,7.5 25.07,10.87 25.07,12.86 v29.67,17.45
RXD/IO44  (via drill 0.3)
  Top 0.305: v9.42,35.84 J1.10 | U1.36 v27.07,37.77 v27.08,37.77
  Bottom 0.305: v27.08,37.77 26.95,37.64 11.23,37.64 v9.42,35.84
TXD/IO43  (via drill 0.3)
  Top 0.305: U1.37 v25.8,38.3 v25.81,38.31 | J1.8 7.95,38.23 v9.45,38.23
  Bottom 0.305: v25.81,38.31 25.73,38.23 v9.45,38.23
USB_D+
  Top 0.254: 46.35,9.43 46.35,9.32 46.61,9.07 46.33,8.79
  Top 0.305: USB.A6 46.33,9.1 | 46.33,9.1 46.33,10.03 45.62,10.75 45.62,11.99 R41.1 | USB.B6 47.33,8.91 47.17,9.07 46.61,9.07 46.36,9.07 46.33,9.1
USB_D-
  Top 0.305: R40.1 44.04,11.43 45.83,9.64 USB.B7 45.83,7.1 46.05,6.89 46.71,6.89 46.83,7.01 USB.A7
VRTC
  Top 0.305: C25.2 13.79,47.68 13.84,47.73 14.68,47.73 | Q3.2 15.41,47.58 D5.- 14.68,47.73 | U3.8 15.93,53.82 | 15.93,53.82 15.34,53.82 14.76,53.24 14.76,47.8 14.68,47.73 | 15.93,53.82 15.82,53.93 C8.2 R2.2
  pour Top: 15.82,45.57 14.94,45.57 14.4,46.1 13.36,46.1 13.36,48.95 14.25,49.84 14.25,53.62 15.16,54.54 15.16,57.89 16.31,57.89 16.31,54.97 17.2,54.08 17.2,53.65 15.95,53.65 15.37,53.06 15.37,48.92 15.67,48.62 15.82,48.47

### Text on the board
tPlace: 1 | 16 | M+ | M- | www.makerfabs.com | MaTouch DevKit_1.28" Controller V1.1 | CR1220